# Altium schematic sheet OTP6.SchDoc
size Letter
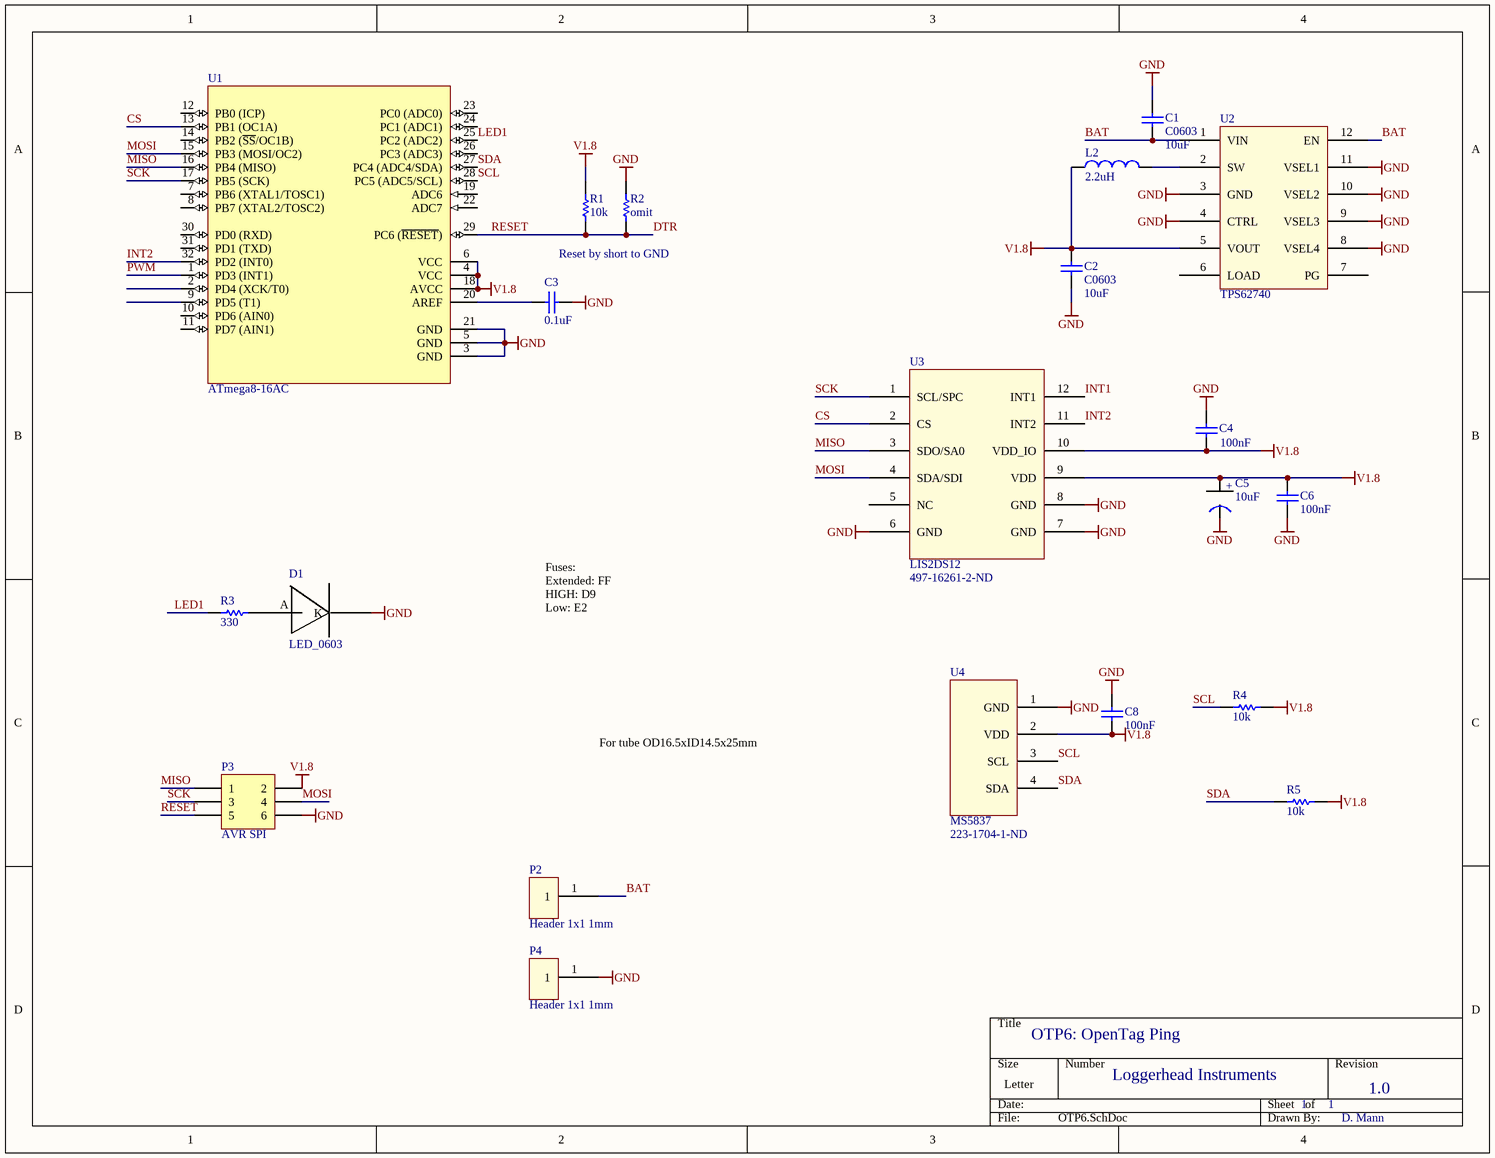
[diagram p0: OTP6.SchDoc]

## Parts
C1  C0603  value 10uF  [0603]
C2  C0603  value 10uF  [0603]
C3  0.1uF  [0402]
C4  100nF  [0402]
C5  10uF  [Tant0805]
C6  100nF  [0402]
C8  100nF  [0402]
D1  LED_0603  [Diode0603]
L2  2.2uH  [Inductor KLZ1608AHR]
P2  Header 1x1 1mm  [Header1x1mm]
P3  AVR SPI  [HDR2X3]
P4  Header 1x1 1mm  [Header1x1mm]
R1  10k  [2-0402]
R2  omit  [3-0603]
R3  330  [2-0402]
R4  10k  [2-0402]
R5  10k  [2-0402]
U1  ATmega8-16AC  [32M1-A_M]
U2  TPS62740  [TPS6274x]
U3  LIS2DS12  Supplier Part Number 1: 497-16261-2-ND  [LGA-12]
U4  MS5837  Supplier Part Number 1: 223-1704-1-ND  [MS5837]

## Nets
GND: C1.2 C2.1 C3.2 C4.2 C5.1(GND) C6.2 C8.2 D1.K P3.6 P4.1 R2.2 U1.3(GND) U1.5(GND) U1.21(GND) U2.3(GND) U2.4(CTRL) U2.8(VSEL4) U2.9(VSEL3) U2.10(VSEL2) U2.11(VSEL1) U3.6(GND) U3.7(GND) U3.8(GND) U4.1(GND)
V1.8: C2.2 C4.1 C5.2(+) C6.1 C8.1 L2.1 P3.2 R1.2 R4.1 R5.1 U1.4(VCC) U1.6(VCC) U1.18(AVCC) U2.5(VOUT) U3.9(VDD) U3.10(VDD_IO) U4.2(VDD)
BAT: C1.1 P2.1 U2.1(VIN) U2.12(EN)
CS: U1.13(PB1_(OC1A)) U3.2(CS)
DTR: P3.5 R1.1 R2.1 U1.29(PC6_(~{RESET}))  [also labelled RESET]
INT1: U3.12(INT1)
INT2: U1.32(PD2_(INT0)) U3.11(INT2)
LED1: R3.2 U1.25(PC2_(ADC2))
MISO: P3.1 U1.16(PB4_(MISO)) U3.3(SDO/SA0)
MOSI: P3.4 U1.15(PB3_(MOSI/OC2)) U3.4(SDA/SDI)
PWM: U1.1(PD3_(INT1))
SCK: P3.3 U1.17(PB5_(SCK)) U3.1(SCL/SPC)
SCL: R4.2 U1.28(PC5_(ADC5/SCL)) U4.3(SCL)
SDA: R5.2 U1.27(PC4_(ADC4/SDA)) U4.4(SDA)
NetC3_1: C3.1 U1.20(AREF)
NetD1_A: D1.A R3.1
NetL2_2: L2.2 U2.2(SW)

Not connected (* = marked no-connect by the designer): U1 2(PD4_(XCK/T0)) 7(PB6_(XTAL1/TOSC1)) 8(PB7_(XTAL2/TOSC2)) 9(PD5_(T1)) 10(PD6_(AIN0)) 11(PD7_(AIN1)) 12(PB0_(ICP)) 14(PB2_(~{SS}/OC1B)) 19(ADC6) 22(ADC7) 23(PC0_(ADC0)) 24(PC1_(ADC1)) 26(PC3_(ADC3)) 30(PD0_(RXD)) 31(PD1_(TXD)); U2 6(LOAD) 7(PG); U3 5(NC)

## Notes on the sheet
- Reset by short to GND
- Fuses:
  Extended: FF
  HIGH: D9
  Low: E2
- For tube OD16.5xID14.5x25mm
- OTP6: OpenTag Ping
- Loggerhead Instruments
- 1
- 1.0
- D. Mann

## Library data of the parts
C1 C2 = C0603: Ceramic Chip Capacitor - Standard; Note: Footprint corresponds to dimensions for bulk cassette packaging. This case size has tightened tolerances.; Published: 17-Jul-2002; LatestRevisionDate: 19-Mar-2004; LatestRevisionNote: Silkscreen size reduced.; DatasheetDocument: Mar-2001; PackageDocument: Mar-2001; PackageReference: 0603; Publisher: Altium Limited; Code_JEITA: 0603; Code_IPC: 1608 [0603]; ComponentLink1Description: Manufacturer Link; ComponentLink1URL: http://www.kemet.com/; ComponentLink2Description: Datasheet; ComponentLink2URL: http://www.kemet.com/kemet/web/homepage/kechome.nsf/vapubfilesname/F3102TA.pdf/$file/F3102TA.pdf
C3 = C0402: Ceramic Chip Capacitor - Standard; Note: Footprint corresponds to dimensions for bulk cassette packaging. This case size has tightened tolerances.; Published: 17-Jul-2002; LatestRevisionDate: 19-Mar-2004; LatestRevisionNote: Silkscreen size reduced.; DatasheetDocument: Mar-2001; PackageDocument: Mar-2001; PackageReference: 0402; Publisher: Altium Limited; Code_JEITA: 0402; Code_IPC: 1005 [0402]; ComponentLink1Description: Manufacturer Link; ComponentLink1URL: http://www.kemet.com/; ComponentLink2Description: Datasheet; ComponentLink2URL: http://www.kemet.com/kemet/web/homepage/kechome.nsf/vapubfilesname/F3102TA.pdf/$file/F3102TA.pdf; Value: 0.1uF
C4 C6 C8 = C0402: Ceramic Chip Capacitor - Standard; Note: Footprint corresponds to dimensions for bulk cassette packaging. This case size has tightened tolerances.; Value: 100pF; Published: 17-Jul-2002; LatestRevisionDate: 19-Mar-2004; LatestRevisionNote: Silkscreen size reduced.; DatasheetDocument: Mar-2001; PackageDocument: Mar-2001; PackageReference: 0402; Publisher: Altium Limited; Code_JEITA: 0402; Code_IPC: 1005 [0402]; ComponentLink1Description: Manufacturer Link; ComponentLink1URL: http://www.kemet.com/; ComponentLink2Description: Datasheet; ComponentLink2URL: http://www.kemet.com/kemet/web/homepage/kechome.nsf/vapubfilesname/F3102TA.pdf/$file/F3102TA.pdf
C5 = Tant0805: Value: 10uF
L2 = Inductor KLZ1608: Supplier 1: Mouser; Supplier Part Number 1: 810-KLZ1608AHR2R2WTD
P2 P4 = Header 1x1 1mm: 1mm through hole
P3 = Header 3X2: Header, 3-Pin, Dual row; LatestRevisionDate: 17-Jul-2002; LatestRevisionNote: Re-released for DXP Platform.; Publisher: Altium Limited
R1 R3-R5 = ERJ2RB: Precision Thick Film Chip Resistor, 10 Ohm to 1M Ohm Range, 1% and 0.5% Tolerance, 0402 Size, 0.063 W; Published: 17-Dec-2003; LatestRevisionDate: 19-Mar-2004; LatestRevisionNote: Silkscreen size reduced.; PackageDocument: Mar-2003; PackageReference: 2-0402; Publisher: Altium Limited; Code_IPC: 1005 [0402]; ComponentLink1Description: Manufacturer Link; ComponentLink1URL: http://www.panasonic.com/industrial/components/resistive_products.htm; ComponentLink2Description: Datasheet; ComponentLink2URL: http://www.panasonic.com/industrial/components/pdf/AOA0000CE2.pdf
R2 = ERJ3RK: Precision Thick Film Chip Resistor, 10 Ohm to 1M Ohm Range, 1% and 0.5% Tolerance, 0603 Size, 0.063 W; Published: 17-Dec-2003; LatestRevisionDate: 19-Mar-2004; LatestRevisionNote: Silkscreen size reduced.; PackageDocument: Mar-2003; PackageReference: 3-0603; Publisher: Altium Limited; Code_IPC: 1608 [0603]; ComponentLink1Description: Manufacturer Link; ComponentLink1URL: http://www.panasonic.com/industrial/components/resistive_products.htm; ComponentLink2Description: Datasheet; ComponentLink2URL: http://www.panasonic.com/industrial/components/pdf/AOA0000CE2.pdf
U1 = ATmega8-16AC: 8-Bit AVR Microcontroller with 8K Bytes of In-System Programmable Flash Memory; Published: 17-Sep-2003; LatestRevisionDate: 13-Apr-2006; LatestRevisionNote: IPC-7351 Footprint Added.; DatasheetVersion: 2486H-AVR-09/02; PackageVersion: revB, Oct-2001; PackageReference: 32A; Publisher: Altium Limited; PackageDescription: 32-Pin Thin Quad Flat Pack 0.8 mm Pitch; Code_JEDEC: MS-026-ABA; ComponentLink1Description: Manufacturer Link; ComponentLink1URL: http://www.atmel.com; ComponentLink2Description: Datasheet; ComponentLink2URL: http://www.atmel.com/dyn/resources/prod_documents/doc2486.pdf
U2 = TPS6274x: Supplier 1: Farnell
U4 = MS5837: Pressure/Temp; Supplier 1: Digi-Key
U3 = LIS2DS12: Supplier 1: Digi-Key